# Altium schematic sheet MeasurementCircuit.SchDoc
size 322 x 215 mm; SheetNumber: 2; SheetTotal: 2
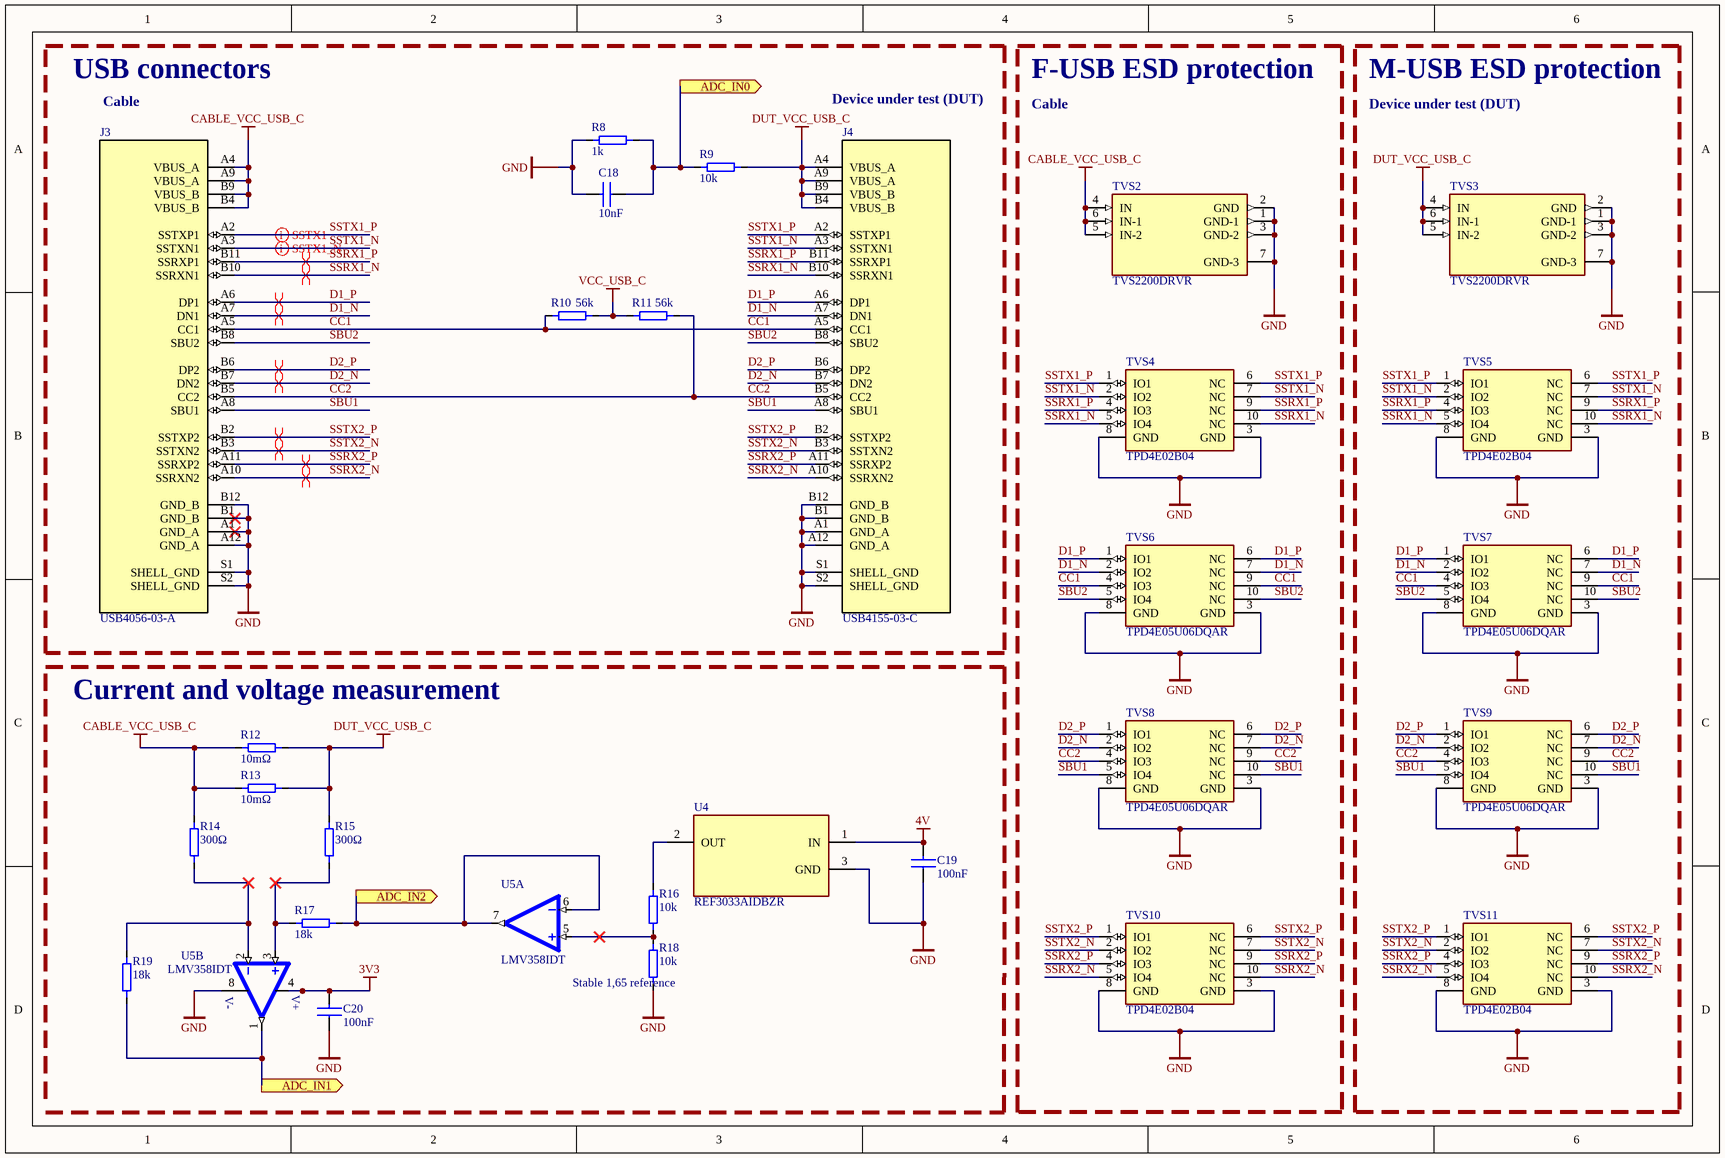
[diagram p0: MeasurementCircuit.SchDoc]

## Parts
C18  10nF  [C0402]
C19  100nF  [C0402]
C20  100nF  [C0402]
J3  USB4056-03-A  [usb4056-03-a]
J4  USB4155-03-C  [USB4155-03-C]
R8  1k  [R0805]
R9  10k  [R0805]
R10  56k  [R0402]
R11  56k  [R0402]
R12  10mΩ  [R1206]
R13  10mΩ  [R1206]
R14  300Ω  [R0402]
R15  300Ω  [R0402]
R16  10k  [R0402]
R17  18k  [R0402]
R18  10k  [R0402]
R19  18k  [R0402]
TVS2  TVS2200DRVR  [TVS2200DRVR]
TVS3  TVS2200DRVR  [TVS2200DRVR]
TVS4  TPD4E02B04  [TPD4E02B04]
TVS5  TPD4E02B04  [TPD4E02B04]
TVS6  TPD4E05U06DQAR  [TPD4E05U06DQAR]
TVS7  TPD4E05U06DQAR  [TPD4E05U06DQAR]
TVS8  TPD4E05U06DQAR  [TPD4E05U06DQAR]
TVS9  TPD4E05U06DQAR  [TPD4E05U06DQAR]
TVS10  TPD4E02B04  [TPD4E02B04]
TVS11  TPD4E02B04  [TPD4E02B04]
U4  REF3033AIDBZR  [REF3033AIDBZR]
U5  LMV358IDT  [LMV358IDT]  (parts A,B of 2)

## Blocks framed on the sheet
USB connectors: C18 J3 J4 R8-R11
F-USB ESD protection: TVS2 TVS4 TVS6 TVS8 TVS10
M-USB ESD protection: TVS3 TVS5 TVS7 TVS9 TVS11

## Ports
ADC_IN0 (out, see STM32[2A]), ADC_IN1 (out, see STM32[2A]), ADC_IN2 (out, see STM32[2A])

## Nets
3V3: C20.2 U5.4(VDD)
4V: C19.2 U4.1(IN)
CABLE_VCC_USB_C: J3.A4(VBUS_A) J3.A9(VBUS_A) J3.B4(VBUS_B) J3.B9(VBUS_B) R12.2 R13.2 R14.1 TVS2.4(IN) TVS2.5(IN-2) TVS2.6(IN-1)
DUT_VCC_USB_C: J4.A4(VBUS_A) J4.A9(VBUS_A) J4.B4(VBUS_B) J4.B9(VBUS_B) R9.2 R12.1 R13.1 R15.1 TVS3.4(IN) TVS3.5(IN-2) TVS3.6(IN-1)
GND: C18.2 C19.1 C20.1 J3.A1(GND_A) J3.A12(GND_A) J3.B1(GND_B) J3.B12(GND_B) J3.S1(SHELL_GND) J3.S2(SHELL_GND) J4.A1(GND_A) J4.A12(GND_A) J4.B1(GND_B) J4.B12(GND_B) J4.S1(SHELL_GND) J4.S2(SHELL_GND) R8.1 R18.1 TVS2.1(GND-1) TVS2.2(GND) TVS2.3(GND-2) TVS2.7(GND-3) TVS3.1(GND-1) TVS3.2(GND) TVS3.3(GND-2) TVS3.7(GND-3) TVS4.3(GND) TVS4.8(GND) TVS5.3(GND) TVS5.8(GND) TVS6.3(GND) TVS6.8(GND) TVS7.3(GND) TVS7.8(GND) TVS8.3(GND) TVS8.8(GND) TVS9.3(GND) TVS9.8(GND) TVS10.3(GND) TVS10.8(GND) TVS11.3(GND) TVS11.8(GND) U4.3(GND) U5.8(VCC)
VCC_USB_C: R10.2 R11.1
ADC_IN0: C18.1 R8.2 R9.1 ; port ADC_IN0
ADC_IN1: R19.1 U5.1(OUTPUT1) ; port ADC_IN1
ADC_IN2: R17.2 U5.6(INVERTING_INPUT2) U5.7(OUTPUT2) ; port ADC_IN2
CC1: J3.A5(CC1) J4.A5(CC1) R10.1 TVS6.4(IO3) TVS6.9(NC) TVS7.4(IO3) TVS7.9(NC)
CC2: J3.B5(CC2) J4.B5(CC2) R11.2 TVS8.4(IO3) TVS8.9(NC) TVS9.4(IO3) TVS9.9(NC)
D1_N: J3.A7(DN1) J4.A7(DN1) TVS6.2(IO2) TVS6.7(NC) TVS7.2(IO2) TVS7.7(NC)
D1_P: J3.A6(DP1) J4.A6(DP1) TVS6.1(IO1) TVS6.6(NC) TVS7.1(IO1) TVS7.6(NC)
D2_N: J3.B7(DN2) J4.B7(DN2) TVS8.2(IO2) TVS8.7(NC) TVS9.2(IO2) TVS9.7(NC)
D2_P: J3.B6(DP2) J4.B6(DP2) TVS8.1(IO1) TVS8.6(NC) TVS9.1(IO1) TVS9.6(NC)
SBU1: J3.A8(SBU1) J4.A8(SBU1) TVS8.5(IO4) TVS8.10(NC) TVS9.5(IO4) TVS9.10(NC)
SBU2: J3.B8(SBU2) J4.B8(SBU2) TVS6.5(IO4) TVS6.10(NC) TVS7.5(IO4) TVS7.10(NC)
SSRX1_N: J3.B10(SSRXN1) J4.B10(SSRXN1) TVS4.5(IO4) TVS4.10(NC) TVS5.5(IO4) TVS5.10(NC)
SSRX1_P: J3.B11(SSRXP1) J4.B11(SSRXP1) TVS4.4(IO3) TVS4.9(NC) TVS5.4(IO3) TVS5.9(NC)
SSRX2_N: J3.A10(SSRXN2) J4.A10(SSRXN2) TVS10.5(IO4) TVS10.10(NC) TVS11.5(IO4) TVS11.10(NC)
SSRX2_P: J3.A11(SSRXP2) J4.A11(SSRXP2) TVS10.4(IO3) TVS10.9(NC) TVS11.4(IO3) TVS11.9(NC)
SSTX1_N: J3.A3(SSTXN1) J4.A3(SSTXN1) TVS4.2(IO2) TVS4.7(NC) TVS5.2(IO2) TVS5.7(NC)
SSTX1_P: J3.A2(SSTXP1) J4.A2(SSTXP1) TVS4.1(IO1) TVS4.6(NC) TVS5.1(IO1) TVS5.6(NC)
SSTX2_N: J3.B3(SSTXN2) J4.B3(SSTXN2) TVS10.2(IO2) TVS10.7(NC) TVS11.2(IO2) TVS11.7(NC)
SSTX2_P: J3.B2(SSTXP2) J4.B2(SSTXP2) TVS10.1(IO1) TVS10.6(NC) TVS11.1(IO1) TVS11.6(NC)
NetR14_2: R14.2 R19.2 U5.2(INVERTING_INPUT1)
NetR15_2: R15.2 R17.1 U5.3(NON-INVERTING_INPUT1)
NetR16_1: R16.1 R18.2 U5.5(NON-INVERTING_INPUT2)
NetR16_2: R16.2 U4.2(OUT)

## Layout directives
differential pair: D1_N, D1_P, D2_N, D2_P, SSRX1_N, SSRX1_P, SSRX2_N, SSRX2_P, SSTX1_N, SSTX1_P, SSTX2_N, SSTX2_P

## Notes on the sheet
- Cable
- Device under test (DUT)
- (near R12) Current and voltage measurement
- (near U5) Stable 1,65 reference
- (in symbol LMV358IDT, part B) V-; V+

## Library data of the parts
C18-C20 = C: Kondensator ceramiczny SMD; Supplier: *; SupplierURL: *; helpurl: *; Manufacturer: *; PartNumber: *; Price: *; Symbol: *; Package: *; Voltage: *
  C18: Value: 10nF
  C19 C20: Value: 100nF
J3 = USB4056-03-A: USB-C (USB TYPE-C) USB 3.2 Gen 2 (USB 3.1 Gen 2, Superspeed + (USB 3.1)) Receptacle Connector 24 Position Surface Mount, Right Angle; Through Hole
J4 = USB4155-03-C: USB-C (USB TYPE-C) USB 3.2 Gen 2 (USB 3.1 Gen 2, Superspeed + (USB 3.1)) Receptacle Connector 24 Position Surface Mount, Right Angle; Through Hole
R8-R19 = R: Rezystor SMD; Supplier: *; SupplierURL: *; helpurl: *; Manufacturer: *; PartNumber: *; Price: *; Symbol: *; Package: *
  R8: Value: 1k
  R9 R16 R18: Value: 10k
  R10 R11: Value: 56k
  R12 R13: Value: 10mΩ
  R14 R15: Value: 300Ω
  R17 R19: Value: 18k
TVS2 TVS3 = TVS2200DRVR: 22V flat-clamp surge protection device; ComponentLink1Description: New link; ComponentLink1URL: https://www.mouser.pl/ProductDetail/Texas-Instruments/TVS2200DRVR?qs=W0yvOO0ixfHPbvei2cYdIw%3D%3D
TVS6-TVS9 = TPD4E05U06DQAR: ESD Protection Diodes / TVS Diodes 0.66-pF +/-3.6-V +/- 30-kV ESD protectio; ComponentLink1Description: New link; ComponentLink1URL: https://www.mouser.pl/ProductDetail/Texas-Instruments/TPD4E05U06DQAR?qs=%2FCrDlo5IrVPi4woOvWz0qA%3D%3D
U4 = REF3033AIDBZR: 3.3-V voltage reference;   50-ppm/°C, 50-µA in 3-pin SOT-23 package series (bandgap)
U5 = LMV358IDT: Standard (General Purpose) Amplifier 2 Circuit Rail-to-Rail 8-SOIC
TVS4 TVS5 TVS10 TVS11 = TPD4E02B04: ComponentLink1Description: New link; ComponentLink1URL: https://www.mouser.pl/ProductDetail/Texas-Instruments/TPD4E02B04DQAR?qs=8%2FmU9qzJpL%2FFVYtHO1iV9g%3D%3D